# Altium schematic sheet debug_board.SchDoc
size A4; SheetNumber: 1; SheetTotal: 8
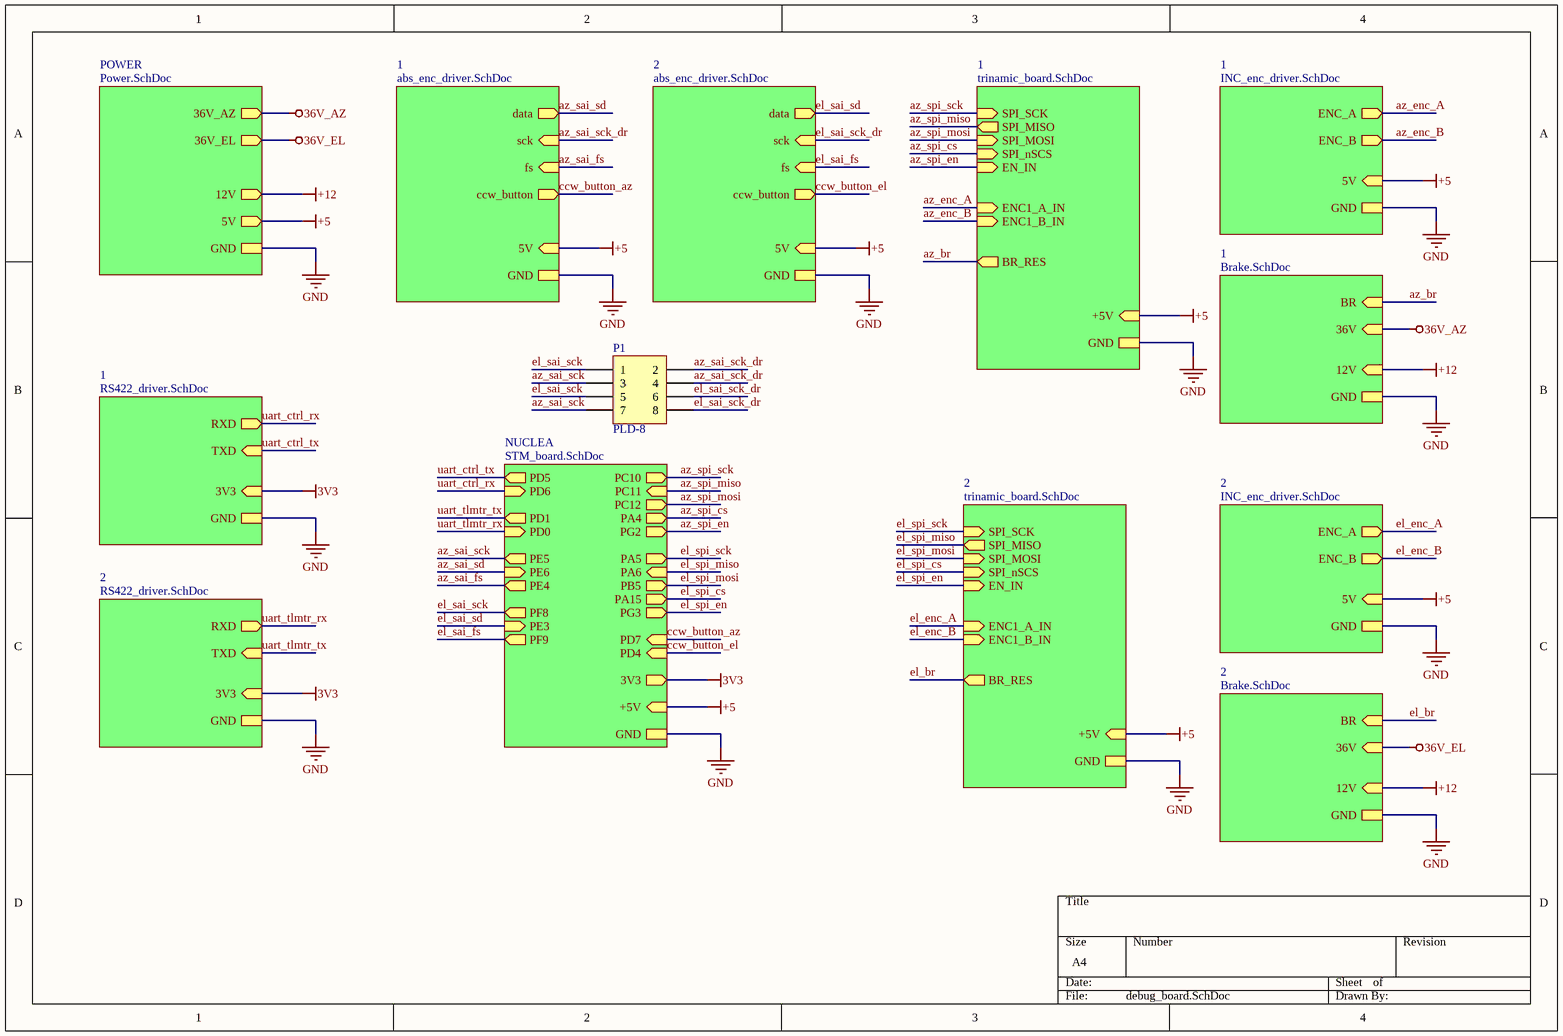
[diagram p0: debug_board.SchDoc]

## Parts
P1  PLD-8  [PLD-8]

## Sub-sheets
1 = trinamic_board.SchDoc: +5V (in), GND, SPI_SCK (in), SPI_MISO (out), SPI_MOSI (in), SPI_nSCS (in), EN_IN (in), ENC1_A_IN (in), ENC1_B_IN (in), BR_RES (out)
1 = abs_enc_driver.SchDoc: fs (in), 5V (in), GND, data (out), sck (in), ccw_button (out)
1 = RS422_driver.SchDoc: 3V3 (in), GND, RXD (out), TXD (in)
1 = INC_enc_driver.SchDoc: 5V (in), GND, ENC_A (out), ENC_B (out)
1 = Brake.SchDoc: 12V (in), GND, 36V (in), BR (in)
2 = trinamic_board.SchDoc: +5V (in), GND, SPI_SCK (in), SPI_MISO (out), SPI_MOSI (in), SPI_nSCS (in), EN_IN (in), ENC1_A_IN (in), ENC1_B_IN (in), BR_RES (out)
2 = INC_enc_driver.SchDoc: 5V (in), GND, ENC_A (out), ENC_B (out)
2 = Brake.SchDoc: 12V (in), GND, 36V (in), BR (in)
2 = abs_enc_driver.SchDoc: fs (in), 5V (in), GND, data (out), sck (in), ccw_button (out)
2 = RS422_driver.SchDoc: 3V3 (in), GND, RXD (out), TXD (in)
NUCLEA = STM_board.SchDoc: PD5 (out), PD6 (in), PD0 (in), PD1 (out), PE5 (out), PE4 (out), PE6 (in), PF8 (out), PF9 (out), PE3 (in), +5V (in), GND, PC10 (out), PC11 (in), PC12 (out), PA4 (out), PG2 (out), PA5 (out), PA6 (in), PB5 (out), PA15 (out), PG3 (out), PD7 (in), PD4 (in), 3V3 (out)
POWER = Power.SchDoc: 12V (out), 5V (out), GND, 36V_EL (out), 36V_AZ (out)

## Nets
3V3: sheet NUCLEA/3V3, sheet 1/3V3, sheet 2/3V3
36V_AZ: sheet POWER/36V_AZ, sheet 1/36V
36V_EL: sheet POWER/36V_EL, sheet 2/36V
+5: sheet POWER/5V, sheet NUCLEA/+5V, sheet 1/+5V, sheet 1/5V, sheet 1/5V, sheet 2/+5V, sheet 2/5V, sheet 2/5V
+12: sheet POWER/12V, sheet 1/12V, sheet 2/12V
GND: sheet POWER/GND, sheet NUCLEA/GND, sheet 1/GND, sheet 1/GND, sheet 1/GND, sheet 1/GND, sheet 1/GND, sheet 2/GND, sheet 2/GND, sheet 2/GND, sheet 2/GND, sheet 2/GND
az_br: sheet 1/BR_RES, sheet 1/BR
az_enc_A: sheet 1/ENC1_A_IN, sheet 1/ENC_A
az_enc_B: sheet 1/ENC1_B_IN, sheet 1/ENC_B
az_sai_fs: sheet NUCLEA/PE4, sheet 1/fs
az_sai_sck: P1.3 P1.7 ; sheet NUCLEA/PE5
az_sai_sck_dr: P1.2 P1.4 ; sheet 1/sck
az_sai_sd: sheet NUCLEA/PE6, sheet 1/data
az_spi_cs: sheet NUCLEA/PA4, sheet 1/SPI_nSCS
az_spi_en: sheet NUCLEA/PG2, sheet 1/EN_IN
az_spi_miso: sheet NUCLEA/PC11, sheet 1/SPI_MISO
az_spi_mosi: sheet NUCLEA/PC12, sheet 1/SPI_MOSI
az_spi_sck: sheet NUCLEA/PC10, sheet 1/SPI_SCK
ccw_button_az: sheet NUCLEA/PD7, sheet 1/ccw_button
ccw_button_el: sheet NUCLEA/PD4, sheet 2/ccw_button
el_br: sheet 2/BR_RES, sheet 2/BR
el_enc_A: sheet 2/ENC1_A_IN, sheet 2/ENC_A
el_enc_B: sheet 2/ENC1_B_IN, sheet 2/ENC_B
el_sai_fs: sheet NUCLEA/PF9, sheet 2/fs
el_sai_sck: P1.1 P1.5 ; sheet NUCLEA/PF8
el_sai_sck_dr: P1.6 P1.8 ; sheet 2/sck
el_sai_sd: sheet NUCLEA/PE3, sheet 2/data
el_spi_cs: sheet NUCLEA/PA15, sheet 2/SPI_nSCS
el_spi_en: sheet NUCLEA/PG3, sheet 2/EN_IN
el_spi_miso: sheet NUCLEA/PA6, sheet 2/SPI_MISO
el_spi_mosi: sheet NUCLEA/PB5, sheet 2/SPI_MOSI
el_spi_sck: sheet NUCLEA/PA5, sheet 2/SPI_SCK
uart_ctrl_rx: sheet NUCLEA/PD6, sheet 1/RXD
uart_ctrl_tx: sheet NUCLEA/PD5, sheet 1/TXD
uart_tlmtr_rx: sheet NUCLEA/PD0, sheet 2/RXD
uart_tlmtr_tx: sheet NUCLEA/PD1, sheet 2/TXD

## Library data of the parts
P1 = PLD-8: Разъем штыревой на плату (папа); Производитель: Connfly electronic (Zhenqin); Номинал: 1А; Напряжение: 300В; Вид монтажа: DIP; Температурный диапазон: -55…140; Примечание: шаг 2.54 мм; Название: PLD-8; Артикул: PLD-8; Тип элемента: Разъем